# Altium schematic sheet DigitalIsolation.SchDoc
size A4; CompanyName: Technische Hochschule Nürnberg Georg Simon Ohm; Organization: UltraZohm; Address1: Kesslerplatz 12; Address2: 90489 Nürnberg; Address3: GERMANY; DocumentNumber: 2; SheetNumber: 2; SheetTotal: 2; Website: www.ultrazohm.com
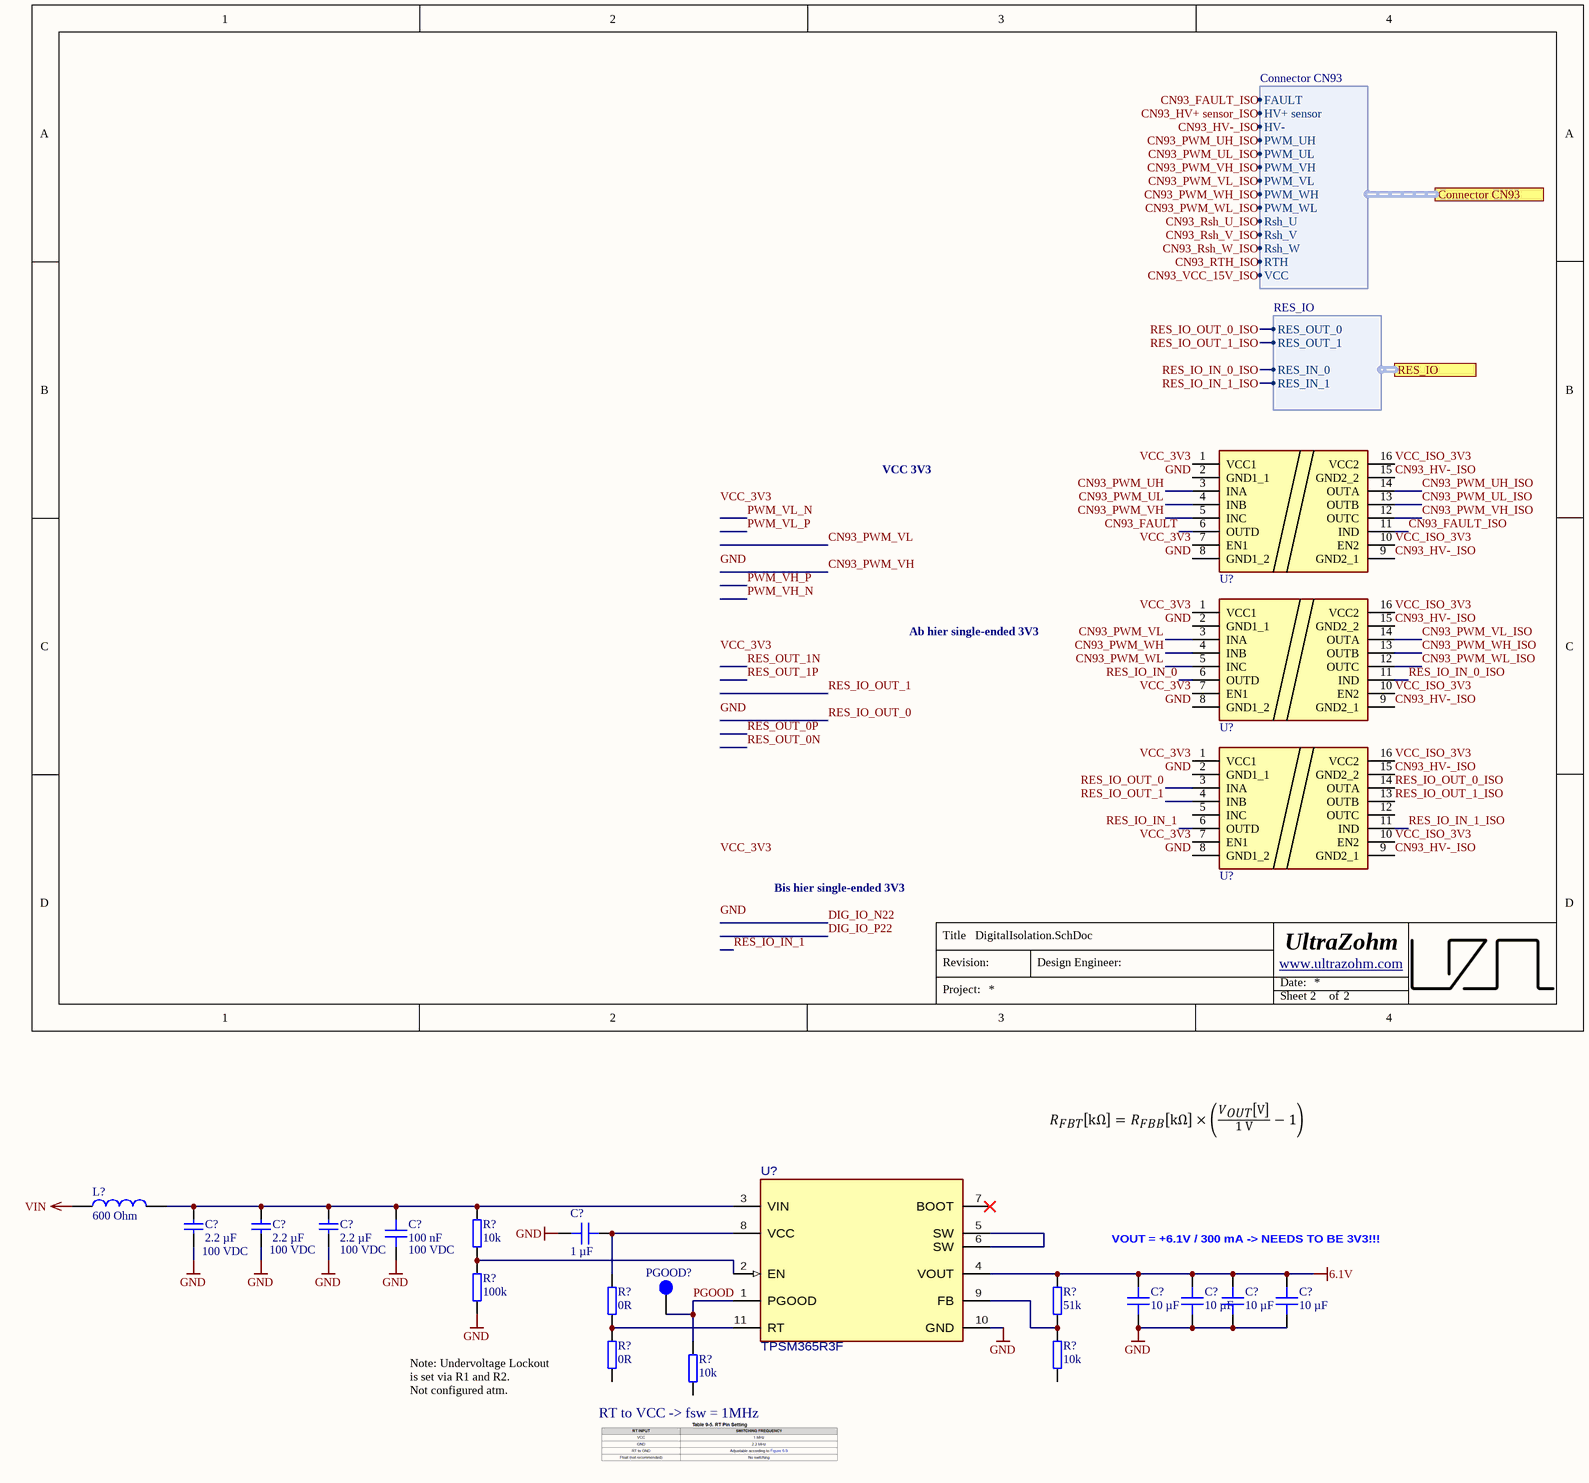
[diagram p0: DigitalIsolation.SchDoc]

## Parts
(Parts that share a designator on the sheet are numbered #1, #2 ... from top to bottom, then left to right.)
C?#1  2.2 µF  Voltage Rating: 100 VDC  [C_1210_TE]
C?#2  2.2 µF  Voltage Rating: 100 VDC  [C_1210_TE]
C?#3  2.2 µF  Voltage Rating: 100 VDC  [C_1210_TE]
C?#4  100 nF  Voltage Rating: 100 VDC  [C_0603]
C?#5  1 µF  [C_0603]
C?#6  10 µF  [C0805]
C?#7  10 µF  [C0805]
C?#8  10 µF  [C0805]
C?#9  10 µF  [C0805]
L?  600 Ohm  [WE-CBF_0805_High Current]
PGOOD?  Testpoint 1mm  [TP_1mm]  (value not drawn)  (no BOM)
R?#1  10k  [RES 0603_1608]
R?#2  100k  [RES 0603_1608]
R?#3  0R  [RES 0603_1608]
R?#4  51k  [R_0603_TE]
R?#5  0R  [RES 0603_1608]
R?#6  10k  [RES 0603_1608]
R?#7  10k  [RES 0603_1608]
U?#1  ISO6441DWR  [SOIC-16]  (value not drawn)
U?#2  ISO6441DWR  [SOIC-16]  (value not drawn)
U?#3  ISO6441DWR  [SOIC-16]  (value not drawn)
U?#4  TPSM365R3F  [RDN0011A-MFG]

## Ports
Connector CN93 (harness Connector CN93), RES_IO (harness RES_IO)

## Harnesses
Connector CN93: FAULT, HV+ sensor, HV-, PWM_UH, PWM_UL, PWM_VH, PWM_VL, PWM_WH, PWM_WL, Rsh_U, Rsh_V, Rsh_W, RTH, VCC
RES_IO: RES_OUT_0, RES_OUT_1, RES_IN_1, RES_IN_0

## Nets
6.1V: C?#6.2 C?#7.2 C?#8.2 C?#9.2 R?#4.2 U?#4.4(VOUT)
GND: C?#1.2 C?#2.2 C?#3.2 C?#4.1 C?#5.2 C?#6.1 C?#7.1 C?#8.1 C?#9.1 R?#2.2 U?#1.2(GND1_1) U?#1.8(GND1_2) U?#2.2(GND1_1) U?#2.8(GND1_2) U?#3.2(GND1_1) U?#3.8(GND1_2) U?#4.10(GND)
VIN: L?.1
CN93_FAULT: U?#1.6(OUTD)
CN93_FAULT_ISO: U?#1.11(IND) ; port Connector CN93.FAULT
CN93_HV+ sensor_ISO: port Connector CN93.HV+ sensor
CN93_HV-_ISO: U?#1.9(GND2_1) U?#1.15(GND2_2) U?#2.9(GND2_1) U?#2.15(GND2_2) U?#3.9(GND2_1) U?#3.15(GND2_2) ; port Connector CN93.HV-
CN93_PWM_UH: U?#1.3(INA)
CN93_PWM_UH_ISO: U?#1.14(OUTA) ; port Connector CN93.PWM_UH
CN93_PWM_UL: U?#1.4(INB)
CN93_PWM_UL_ISO: U?#1.13(OUTB) ; port Connector CN93.PWM_UL
CN93_PWM_VH: U?#1.5(INC)
CN93_PWM_VH_ISO: U?#1.12(OUTC) ; port Connector CN93.PWM_VH
CN93_PWM_VL: U?#2.3(INA)
CN93_PWM_VL_ISO: U?#2.14(OUTA) ; port Connector CN93.PWM_VL
CN93_PWM_WH: U?#2.4(INB)
CN93_PWM_WH_ISO: U?#2.13(OUTB) ; port Connector CN93.PWM_WH
CN93_PWM_WL: U?#2.5(INC)
CN93_PWM_WL_ISO: U?#2.12(OUTC) ; port Connector CN93.PWM_WL
CN93_Rsh_U_ISO: port Connector CN93.Rsh_U
CN93_Rsh_V_ISO: port Connector CN93.Rsh_V
CN93_Rsh_W_ISO: port Connector CN93.Rsh_W
CN93_RTH_ISO: port Connector CN93.RTH
CN93_VCC_15V_ISO: port Connector CN93.VCC
PGOOD: PGOOD?.1 R?#7.1 U?#4.1(PGOOD)
RES_IO_IN_0: U?#2.6(OUTD)
RES_IO_IN_0_ISO: U?#2.11(IND) ; port RES_IO.RES_IN_0
RES_IO_IN_1: U?#3.6(OUTD)
RES_IO_IN_1_ISO: U?#3.11(IND) ; port RES_IO.RES_IN_1
RES_IO_OUT_0: U?#3.3(INA)
RES_IO_OUT_0_ISO: U?#3.14(OUTA) ; port RES_IO.RES_OUT_0
RES_IO_OUT_1: U?#3.4(INB)
RES_IO_OUT_1_ISO: U?#3.13(OUTB) ; port RES_IO.RES_OUT_1
VCC_3V3: U?#1.1(VCC1) U?#1.7(EN1) U?#2.1(VCC1) U?#2.7(EN1) U?#3.1(VCC1) U?#3.7(EN1)
VCC_ISO_3V3: U?#1.10(EN2) U?#1.16(VCC2) U?#2.10(EN2) U?#2.16(VCC2) U?#3.10(EN2) U?#3.16(VCC2)
NetC?#1_1: C?#1.1 C?#2.1 C?#3.1 C?#4.2 L?.2 R?#1.2 U?#4.3(VIN)
NetC?#5_1: C?#5.1 R?#3.2 U?#4.8(VCC)
NetR?#1_1: R?#1.1 R?#2.1 U?#4.2(EN)
NetR?#3_1: R?#3.1 R?#5.2 U?#4.11(RT)
NetR?#4_1: R?#4.1 R?#6.1 U?#4.9(FB)
NetU?#4_5: U?#4.5(SW) U?#4.6(SW)

Not connected (* = marked no-connect by the designer): R?#5 1; R?#6 2; R?#7 2; U?#3 5(INC) 12(OUTC); U?#4 7(BOOT)*

## Notes on the sheet
- VCC 3V3
- Ab hier single-ended 3V3
- Bis hier single-ended 3V3
- (near C?#6) VOUT = +6.1V / 300 mA -> NEEDS TO BE 3V3!!!
- Note: Undervoltage Lockout is set via R1 and R2.
  Not configured atm.
- (near R?#7) RT to VCC -> fsw = 1MHz
- Labels drawn without touching a wire or pin: GND, VCC_3V3
- Title
- Revision:
- Design Engineer:
- Date:
- Project:
- Sheet
- of

## Library data of the parts
C?#1-C?#3 = FS32X225K101EGG: 100V 2.2uF X7R ±10% 1210 Multilayer Ceramic Capacitors MLCC - SMD/SMT ROHS; Manufacturer: PSA(Prosperity Dielectrics); Created from: AGeiger; Manufacturer Part Number: FS32X225K101EGG; PartID: 170; Created On: 11.03.2025 16:22:30; ComponentLink1Description: Datasheet; ComponentLink1URL: https://www.lcsc.com/datasheet/lcsc_datasheet_2410121308_PSA-Prosperity-Dielectrics-FS32X225K101EGG_C153036.pdf; Component Type: Capacitor 1210; Device Package: 1210; Last Updated: 27.05.2025 19:11:48; Mounting Type: SMD; Operating Temperature: -55 to +125°C; Series: FS; Supplier 1: LCSC; Supplier Part Number 1: C153036; Type: Capacitor; Tolerance: 10%; Value: 2.2 µF; Live Cycle Status: 1; LCSC Part Number: C153036
C?#4 = C1608X7S2A104KT000N: 100V 100nF X7S ±10% 0603 Multilayer Ceramic Capacitors MLCC - SMD/SMT ROHS; Manufacturer: TDK; Created from: AGeiger; Manufacturer Part Number: C1608X7S2A104KT000N; PartID: 148; Created On: 20.12.2020 13:54:13; ComponentLink1Description: Datasheet; ComponentLink1URL: https://datasheet.lcsc.com/lcsc/2304140030_TDK-C1608X7S2A104KT000N_C343025.pdf; Component Type: Capacitor 0603; Device Package: 0603; Last Updated: 14.12.2022 12:14:21; Mounting Type: SMD; Operating Temperature: -55 to 125°C; Series: X7R; Supplier 1: LCSC; Supplier Part Number 1: C343025; Type: Capacitor; Tolerance: 10 %; Value: 100 nF; Live Cycle Status: 1; LCSC Part Number: C343025; Stock number: not stored
C?#5 = CL10A105KB8NNNC: 50V 1uF X5R ±10% 0603  Multilayer Ceramic Capacitors MLCC - SMD/SMT ROHS; Manufacturer: Samsung Electro-Mechanics; Voltage Rating: 50 VDC; Created from: MGremer; Manufacturer Part Number: CL10A105KB8NNNC; PartID: 5; Created On: 20/12/2020 13:54:13; ComponentLink1Description: Datasheet; ComponentLink1URL: https://datasheet.lcsc.com/lcsc/1810261812_Samsung-Electro-Mechanics-CL10A105KB8NNNC_C15849.pdf; Component Type: Capacitor 0603; Device Package: 0603; Last Updated: 28/11/2022 17:23:01; Mounting Type: SMD; Operating Temperature: -55 - 85°C; Series: M; Supplier 1: LCSC; Supplier Part Number 1: C15849; Type: Capacitor; Tolerance: 10 %; Value: 1 µF; Live Cycle Status: 1; Stock number: Labor SMD Container; LCSC Part Number: C15849
C?#6-C?#9 = GRM21BR6YA106KE43L: Capacitor 0805, 35 VDC, 10 µF, X5R; Manufacturer: muRata; Tolerance: 10 %; Voltage Rating: 35 VDC; Created from: MGremer; Manufacturer Part Number: GRM21BR6YA106KE43L; PartID: 28; Created On: 20.12.2020 13:54:13; ComponentLink1Description: Datasheet; ComponentLink1URL: https://www.mouser.de/datasheet/2/281/murata_03052018_GRM_Series_1-1310166.pdf; Component Type: Capacitor 0805; Device Package: 0805; Last Updated: 20.12.2020 17:44:37; Mounting Type: SMD; Operating Temperature: -55 - 85°C; Series: GRM; Supplier 1: Mouser; Supplier Part Number 1: 81-GRM21BR6YA106KE3L; Type: Capacitor; Value: 10 µF; Live Cycle Status: 1; Stock number: Labor SMD Container; LCSC Part Number: C162422
L? = 742792040: Inductance, 0805, 100 MHz, 600 Ohm, 2 A; Manufacturer: Wuerth Elektronik; Type: Inductance SMD; DC current: 2 A; Created from: AGeiger; ComponentLink1Description: Datasheet; ComponentLink1URL: https://www.mouser.de/datasheet/2/445/742792040-1720361.pdf; Value: 600 Ohm; Supplier 1: Mouser; Supplier Part Number 1: 710-742792040; LCSC Part Number: C2661857; Manufacturer Part Number: 742792040; PartID: 1; Created On: 18/01/2021 14:53:17; Component Type: Inductance; Device Package: 0805; Last Updated: 22/08/2024 07:43:45; Mounting Type: SMD; Operating Temperature: -55 - 125 °C; Series: WE-CBF; Live Cycle Status: 1; Stock number: not stored
PGOOD? = NULL: Manufacturer Part Number: NULL; Created from: AGeiger; Created: 2018_06_25_AGeiger; Value: Testpoint 1mm; PartID: 9; Created On: 20.09.2022 13:14:57; Component Type: Testpoint; Last Updated: 20.09.2022 13:15:39; Manufacturer: NULL; Supplier 1: NULL; Supplier Part Number 1: NULL; Type: Testpoint; Live Cycle Status: 1
R?#1 R?#6 R?#7 = 0603WAF1002T5E: SMD resistor 1%; Manufacturer: UNI-ROYAL; Created from: AGeiger; Manufacturer Part Number: 0603WAF1002T5E; PartID: 265; Created On: 01/06/2023 06:49:29; Value: 10k; Device Package: 0603; Tolerance: 1%; Mounting Type: SMD; Last Updated: 01/06/2023 06:49:29; ComponentLink1Description: Datasheet; ComponentLink1URL: https://datasheet.lcsc.com/lcsc/2206010045_UNI-ROYAL-Uniroyal-Elec-0603WAF1002T5E_C25804.pdf; Component Type: SMD resistor; Supplier 1: LCSC; Supplier Part Number 1: C25804; Type: Resistor; Live Cycle Status: 1; LCSC Part Number: C25804
R?#2 = CRCW0603100KFKEAC: SMD resistor 1%; Manufacturer: Vishay; Created from: MGremer; Manufacturer Part Number: CRCW0603100KFKEAC; PartID: 181; Created On: 14/12/2020 16:17:14; Value: 100k; Device Package: 0603; Tolerance: 1%; Mounting Type: SMD; Last Updated: 21/05/2021 10:03:40; ComponentLink1Description: Datasheet; ComponentLink1URL: https://www.mouser.de/datasheet/2/427/crcwce3-1762584.pdf; Component Type: SMD resistor; Supplier 1: Mouser; Supplier Part Number 1: 71-CRCW0603100KFKEAC; Type: Resistor; Live Cycle Status: 1; Stock number: not stored
R?#3 R?#5 = RC0603JR-070RL: SMD resistor E24 series; Manufacturer: YAGEO; Tolerance: 5%; Created from: MGremer; Manufacturer Part Number: RC0603JR-070RL; PartID: 1; Created On: 14/12/2020 16:17:14; ComponentLink1Description: Datasheet; ComponentLink1URL: https://www.mouser.de/datasheet/2/447/PYu-RC_Group_51_RoHS_L_10-1664068.pdf; Component Type: SMD resistor; Device Package: 0603; Last Updated: 04/03/2021 09:09:42; Mounting Type: SMD; Supplier 1: Mouser; Supplier Part Number 1: 603-RC0603JR-070RL; Supplier 2: LCSC; Supplier Part Number 2: C21189; Type: Resistor; Value: 0R; Live Cycle Status: 1; Stock number: Labor SMD Container; LCSC Part Number: C21189
R?#4 = 0603WAF5102T5E: 100mW Thick Film Resistors 75V ±100ppm/℃ ±1% 51kΩ 0603 Chip Resistor - Surface Mount ROHS; Manufacturer: UNI-ROYAL(Uniroyal Elec); Created from: KIlhan; Manufacturer Part Number: 0603WAF5102T5E; PartID: 363; Created On: 16/06/2025 17:07:49; ComponentLink1Description: Datasheet; ComponentLink1URL: https://jlcpcb.com/api/file/downloadByFileSystemAccessId/8579706288655699968; Component Type: SMD resistor; Device Package: 0603; Last Updated: 18/06/2025 13:28:44; Mounting Type: SMD; Supplier 1: LCSC; Supplier Part Number 1: C23196; Type: Resistor; Tolerance: 1%; Value: 51k; Live Cycle Status: 1; Stock number: not stored; LCSC Part Number: C23196
U?#1-U?#3 = ISO6441DWR: Digitale Isolatoren General-purpose quad channel 3/1 digital; Manufacturer: Texas Instruments; Created from: FRosner; Manufacturer Part Number: ISO6441DWR; PartID: 19; Created On: 01.06.2026 09:00:50; ComponentLink1Description: Datasheet; ComponentLink1URL: https://www.ti.com.cn/cn/lit/ds/symlink/iso6441.pdf; Component Type: Digital Isolator; Device Package: SOIC-16; Last Updated: 01.06.2026 09:00:50; Mounting Type: SMD; Operating Temperature: -40 to +125 °C; Series: ISO6441; Supplier 1: Mouser; Supplier Part Number 1: 595-ISO6441DWR; Supplier 2: LCSC; Supplier Part Number 2: C49303131; Type: Digital Isolator; Value: ISO6441DWR; LCSC Part Number: C49303131
U?#4 = TPSM365R6FRDNR: 3-V to 65-V input, 1-V to 13-V output, 0.6-A synchronous buck converter power module; Manufacturer Part Number: TPSM365R3FRDNR; Manufacturer: Texas Instruments; Created from: KIlhan; PartID: 42; Created On: 16/06/2025 17:12:20; ComponentLink1Description: Datasheet; ComponentLink1URL: https://www.ti.com/lit/ds/symlink/tpsm365r3.pdf?ts=1747982141267; Component Type: Power module with inductor; Device Package: QFN-FCMOD; Last Updated: 16/06/2025 17:12:20; Mounting Type: SMD; Operating Temperature: -40 to +125 °C; Series: TPSM365; Supplier 1: LCSC; Supplier Part Number 1: C20346006; Type: Power module (integrated inductor); Value: TPSM365R3F; Live Cycle Status: 1; LCSC Part Number: C20346006; Stock number: not stored; Supplier 2: Mouser; Supplier Part Number 2: 595-TPSM365R6FRDNR